# EAGLE design drawingBoard (EAGLE 8.0.1)
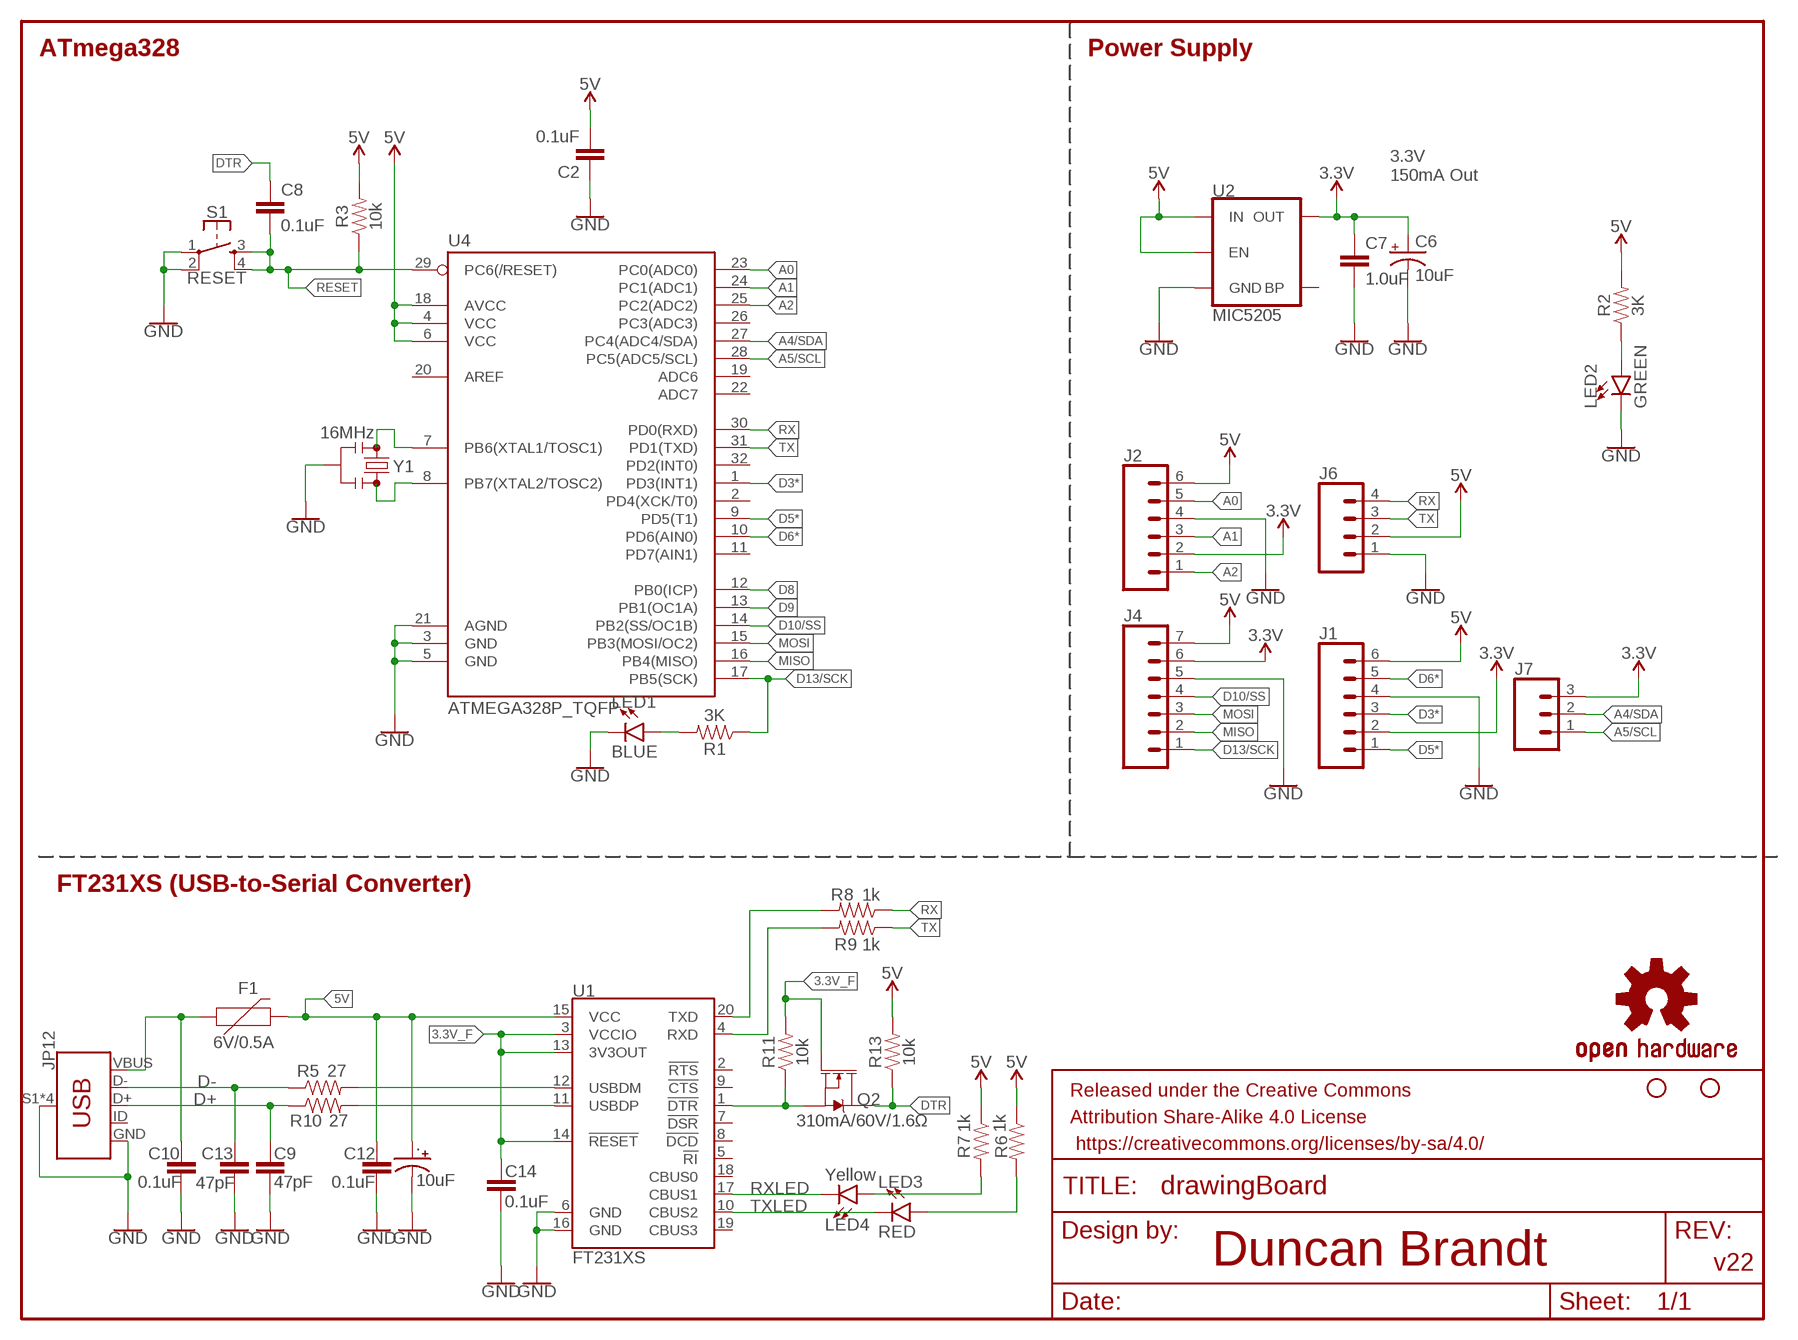
[diagram p0: schematic, sheet 1]

## Parts
.  10uF  10UF-POLAR-EIA3216-16V-10%(TANT)  [EIA3216]
C2  0.1uF  0.1UF-0603-25V-5%  [0603]
C6  10uF  10UF-POLAR-EIA3216-16V-10%(TANT)  [EIA3216]
C7  1.0uF  1.0UF-0603-16V-10%  [0603]
C8  0.1uF  0.1UF-0603-25V-5%  [0603]
C9  47pF  47PF-0603-50V-5%  [0603]
C10  0.1uF  0.1UF-0603-25V-5%  [0603]
C12  0.1uF  0.1UF-0603-25V-5%  [0603]
C13  47pF  47PF-0603-50V-5%  [0603]
C14  0.1uF  0.1UF-0603-25V-5%  [0603]
F1  6V/0.5A  PPTC_HALF-AMP  [1206]
FRAME2  FRAME-LETTER  [CREATIVE_COMMONS]
J1  CONN_06SILK_FEMALE_PTH  [1X06]
J2  CONN_06SILK_FEMALE_PTH  [1X06]
J4  CONN_07  [1X07]
J6  CONN_04  [1X04]
J7  CONN_03  [1X03]
JP3  STAND-OFF  [STAND-OFF]
JP6  STAND-OFF  [STAND-OFF]
JP12  USB_MINI-B_SMT  [USB-MINIB]
LED1  BLUE  LED-BLUE1206  [LED-1206]
LED2  GREEN  LED-GREEN1206  [LED-1206]
LED3  RED  LED-RED1206  [LED-1206]
LED4  Yellow  LED-YELLOW1206  [LED-1206]
Q2  310mA/60V/1.6Ω  MOSFET-NCH-2N7002PW  [SOT323]
R1  3K  3KOHM-0603-1/10W-1%  [0603]
R2  3K  3KOHM-0603-1/10W-1%  [0603]
R3  10k  10KOHM-0603-1/10W-1%  [0603]
R5  27  27OHM-0603-1/10W-1%  [0603]
R6  1k  1KOHM-0603-1/10W-1%  [0603]
R7  1k  1KOHM-0603-1/10W-1%  [0603]
R8  1k  1KOHM-0603-1/10W-1%  [0603]
R9  1k  1KOHM-0603-1/10W-1%  [0603]
R10  27  27OHM-0603-1/10W-1%  [0603]
R11  10k  10KOHM-0603-1/10W-1%  [0603]
R13  10k  10KOHM-0603-1/10W-1%  [0603]
S1  RESET  MOMENTARY-SWITCH-SPST-2-SMD-5.2MM  [TACTILE_SWITCH_SMD_5.2MM]
U1  FT231XS  [SSOP20_L]
U2  MIC5205  VREG3.3V3.3V  [SOT23-5]
U4  ATMEGA328P_TQFP  [TQFP32-08]
U$16  OSHW-LOGOS  [OSHW-LOGO-S]
Y1  16MHz  RESONATOR-16MHZSMD_3.2X1.3  [RESONATOR-SMD-3.2X1.3]

## Nets
3.3V: C6.+ C7.1 J1.2 J2.2 J4.6 J7.3 U2.5(OUT)
3.3V_F: C14.1 Q2.1(G) R11.2 U1.3(VCCIO) U1.13(3V3OUT) U1.14(!RESET)
5V: ..+ C2.2 C12.1 F1.2 J1.6 J2.6 J4.7 J6.2 R2.2 R3.2 R6.1 R7.1 R13.2 U1.15(VCC) U2.1(IN) U2.3(EN) U4.4(VCC) U4.6(VCC) U4.18(AVCC)
A0: J2.5 U4.23(PC0(ADC0))
A1: J2.3 U4.24(PC1(ADC1))
A2: J2.1 U4.25(PC2(ADC2))
A4/SDA: J7.2 U4.27(PC4(ADC4/SDA))
A5/SCL: J7.1 U4.28(PC5(ADC5/SCL))
D3*: J1.3 U4.1(PD3(INT1))
D5*: J1.1 U4.9(PD5(T1))
D6*: J1.5 U4.10(PD6(AIN0))
D8: U4.12(PB0(ICP))
D9: U4.13(PB1(OC1A))
D10/SS: J4.4 U4.14(PB2(SS/OC1B))
D13/SCK: J4.1 R1.1 U4.17(PB5(SCK))
D+: C9.1 JP12.D+ R10.1
D-: C13.1 JP12.D- R5.1
DTR: C8.1 Q2.3(D) R13.1
FTDI_DTR: Q2.2(S) R11.1 U1.1(!DTR)
GND [power]: ..- C2.1 C6.- C7.2 C9.2 C10.2 C12.2 C13.2 C14.2 J1.4 J2.4 J4.5 J6.1 JP12.GND JP12.S1(SHIELD) JP12.S2(SHIELD) JP12.S3(SHIELD) JP12.S4(SHIELD) LED1.C LED2.C S1.1 S1.2 U1.6(GND) U1.16(GND) U2.2(GND) U4.3(GND) U4.5(GND) U4.21(AGND) Y1.2
MISO: J4.2 U4.16(PB4(MISO))
MOSI: J4.3 U4.15(PB3(MOSI/OC2))
N$1: LED1.A R1.2
N$2: LED2.A R2.1
N$3: U4.7(PB6(XTAL1/TOSC1)) Y1.1
N$4: U4.8(PB7(XTAL2/TOSC2)) Y1.3
N$6: R5.2 U1.12(USBDM)
N$7: R10.2 U1.11(USBDP)
N$8: LED3.A R6.2
N$10: LED4.A R7.2
RESET: C8.2 R3.1 S1.3 S1.4 U4.29(PC6(/RESET))
RX: J6.4 R8.1 U4.30(PD0(RXD))
RXD: R9.2 U1.4(RXD)
RXLED: LED4.C U1.17(CBUS1)
TX: J6.3 R9.1 U4.31(PD1(TXD))
TXD: R8.2 U1.20(TXD)
TXLED: LED3.C U1.10(CBUS2)
VUSB: C10.1 F1.1 JP12.VBUS
Unconnected: JP12.ID U1.2(!RTS) U1.5(!RI) U1.7(!DSR) U1.8(!DCD) U1.9(!CTS) U1.18(CBUS0) U1.19(CBUS3) U2.4(BP) U4.2(PD4(XCK/T0)) U4.11(PD7(AIN1)) U4.19(ADC6) U4.20(AREF) U4.22(ADC7) U4.26(PC3(ADC3)) U4.32(PD2(INT0))

## Notes on the sheet
- ATmega328 | Power Supply
- 3.3V
  150mA Out
- FT231XS (USB-to-Serial Converter)
- Duncan Brandt | v22

## Library data of the parts
. C6 = DB-CAP:10UF-POLAR: 10.0µF polarized capacitors Package: EIA3216 A capacitor is a passive two-terminal electrical component used to store electrical energy temporarily in an electric field. DB BOARDS: DB Drawing Board <www.dbboards.com>; PROD_ID: CAP-00811
C2 C8 C10 C12 C14 = DB-CAP:0.1UF: 0.1µF ceramic capacitors Package: 0603 A capacitor is a passive two-terminal electrical component used to store electrical energy temporarily in an electric field. DB BOARDS: DB Drawing Board <www.dbboards.com>; PROD_ID: CAP-08604
C7 = DB-CAP:1.0UF: 1µF ceramic capacitors Package: 0603 A capacitor is a passive two-terminal electrical component used to store electrical energy temporarily in an electric field. DB BOARDS: DB Drawing Board <www.dbboards.com>; PROD_ID: CAP-00868
C9 C13 = DB-CAP:47PF: 47pF ceramic capacitors Package: 0603 A capacitor is a passive two-terminal electrical component used to store electrical energy temporarily in an electric field. DB BOARDS: DB Drawing Board <www.dbboards.com>; PROD_ID: CAP-08913
F1 = DB-FUSE:PPTC: Resettable Fuse PPTC Package: 1206 DB BOARDS: DB Drawing Board <www.dbboards.com>; PROD_ID: RES-08585
FRAME2 = DB-SYMBOLS:FRAME-LETTER: Schematic Frame - Letter Standard 8.5x11 US Letter frame
J1 J2 = DB-CONN:CONN_06: 6 Pin Header Multi connection point. Often used as Generic Header-pin footprint for 0.1 inch spaced/style header connections DB BOARDS: DB Drawing Board <www.dbboards.com>; PROD_ID: CONN-08437
J4 = DB-CONN:CONN_07: 7 Pin Header Multi connection point. Often used as Generic Header-pin footprint for 0.1 inch spaced/style header connections DB BOARDS: DB Drawing Board <www.dbboards.com>
J6 = DB-CONN:CONN_04: 4 Pin Header Single connection point. Often used as Generic Header-pin footprint for 0.1 inch spaced/style header connections DB BOARDS: DB Drawing Board <www.dbboards.com>; PROD_ID: CONN-09696
J7 = DB-CONN:CONN_03: 3 Pin Header Single connection point. Often used as Generic Header-pin footprint for 0.1 inch spaced/style header connections DB BOARDS: DB Drawing Board <www.dbboards.com>
JP3 JP6 = DB-HARDWARE:STAND-OFF: #4 Phillips Hole Screw Hole Mount Hole DB BOARDS: DB Drawing Board <www.dbboards.com>
JP12 = DB-CONN:USB_MINI-B: USB type Mini-B Connector Breaks out 5th pin, and includes shield pins if needed. SparkFun Products: SparkFun FTDI Basic Breakout <https://www.sparkfun.com/products/9716> SparkFun XBee Explorer USB <https://www.sparkfun.com/products/11812> SparkFun Redboard <https://www.sparkfun.com/products/12757>; PROD_ID: CONN-08193; SF_ID: PRT-00587
LED1 = DB-LED:LED-BLUE: Blue SMD LED Package: 1206 DB BOARDS: DB Drawing Board <www.dbboards.com>; PROD_ID: DIO-09911
LED2 = DB-LED:LED-GREEN: Green SMD LED Package: 1206 DB BOARDS: DB Drawing Board <www.dbboards.com>; PROD_ID: DIO-09910
LED3 = DB-LED:LED-RED: Red SMD LED Package: 1206 DB BOARDS: DB Drawing Board <www.dbboards.com>; PROD_ID: DIO-09912
LED4 = DB-LED:LED-YELLOW: Yellow SMD LED Package: 1206 DB BOARDS: DB Drawing Board <www.dbboards.com>; PROD_ID: DIO-09909
Q2 = DB-DESCSEMI:MOSFET-NCH: N-Channel MOSFETs Package: SOT323 DB BOARDS: DB Drawing Board <www.dbboards.com>; PROD_ID: TRANS-11151
R1 R2 = DB-RES:3KOHM: 3kΩ Resistor Package: 0603 A resistor is a passive two-terminal electrical component that implements electrical resistance as a circuit element. Resistors act to reduce current flow, and, at the same time, act to lower voltage levels within circuits. - Wikipedia DB BOARDS: DB Drawing Board <www.dbboards.com>; PROD_ID: RES-09334
R3 R11 R13 = DB-RES:10KOHM: 10kΩ Resistor Package: 0603 A resistor is a passive two-terminal electrical component that implements electrical resistance as a circuit element. Resistors act to reduce current flow, and, at the same time, act to lower voltage levels within circuits. - Wikipedia DB BOARDS: DB Drawing Board <www.dbboards.com>; PROD_ID: RES-00824
R5 R10 = DB-RES:27OHM: 27kΩ Resistor Package: 0603 A resistor is a passive two-terminal electrical component that implements electrical resistance as a circuit element. Resistors act to reduce current flow, and, at the same time, act to lower voltage levels within circuits. - Wikipedia DB BOARDS: DB Drawing Board <www.dbboards.com>; PROD_ID: RES-09334
R6-R9 = DB-RES:1KOHM: 1kΩ Resistor Package: 0603 A resistor is a passive two-terminal electrical component that implements electrical resistance as a circuit element. Resistors act to reduce current flow, and, at the same time, act to lower voltage levels within circuits. - Wikipedia DB BOARDS: DB Drawing Board <www.dbboards.com>; PROD_ID: RES-07856
S1 = DB-BTNSWTCH:MOMENTARY-SWITCH-SPST-2: SMD Momentary Push Button Package: SPST 4PIN DB BOARDS: DB Drawing Board <www.dbboards.com>; PROD_ID: SWCH-08247; SF_SKU: COM-08720
U1 = DB-COMM:FT231X: FTDI FT231X Full Speed USB to Full-handshake UART Package: SSOP20 This USB2.0 Full Speed IC offers a compact bridge to full handshake UART interfaces. The device is a UART, capable of operating up to 3MBaud, with low power consumption (8mA). The FT231X includes the complete FT-X series feature set and enables USB to be added into a system design quickly and easily over a UART interface. DB BOARDS: DB Drawing Board <www.dbboards.com>; PROD_ID: IC-11524
U2 = DB-POWER:VREG3.3V: V-REG 3.3V Package: SOT23-5 Standard 3.3V 150mA LDO voltage regulator in SOT-23 layout. BP (by-pass) pin is used to lower output noise with 470pF cap, may be left open. DB BOARDS: DB Drawing Board <www.dbboards.com>
U4 = DB-IC-Microcontroller:ATMEGA328P_TQFP: ATMEGA 328P Package: TQFP32 Arduino Programmable IC DB BOARDS: DB Drawing Board <www.dbboards.com>; PROD_ID: IC-09069
U$16 = DB-SYMBOLS:OSHW-LOGO: Open-Source Hardware (OSHW) Logo This logo indicates the piece of hardware it is found on incorporates a OSHW license and/or adheres to the definition of open source hardware found here: http://freedomdefined.org/OSHW
Y1 = DB-CLOCK:RESONATOR-16MHZ: 16MHz Resonator Package: 3.2x1.3 DB BOARDS: DB Drawing Board <www.dbboards.com>; PROD_ID: XTAL-08900

## Net classes
0 default: width 0.152 mm, drill 0.305 mm, clearance 0.152 mm
1 power: width 0.254 mm

## Board
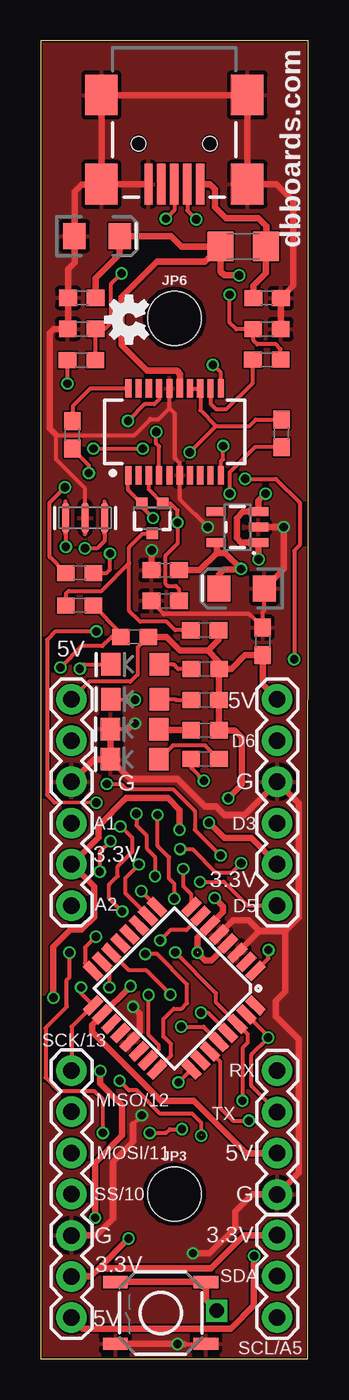
[diagram p1: board, top side]
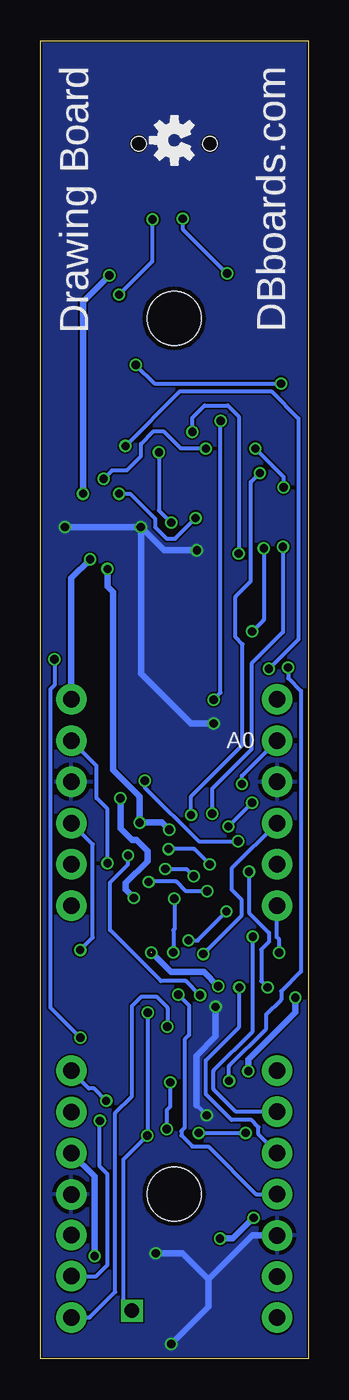
[diagram p2: board, bottom side, seen from below]

Size 16.51 x 81.27 mm. Coordinates in mm from the lower left corner, seen from the top.
Outline: 0,0 16.5,0 16.52,81.27 0,81.27 0,0
Copper layers (1*16): Top 0.035mm / dielectric 1.5mm / Bottom 0.035mm
Design rules "SparkFun-2-layer-FAB-LIMIT": minimum track width 4mil, minimum drill 6mil, track to track 4mil, track to pad 4mil, pad to pad 4mil, via to via 4mil, smd to smd 4mil, copper to edge 4mil, drill to drill 4mil, minimum pad ring 5mil, minimum via ring 5mil, stop-mask expansion 4mil, vias tented up to drill 25mil, thermal gap 10mil

### Footprints (pad centres in the part's own frame; a part is rotated, then mirrored left to right if it is on the bottom)
EIA3216 = smd 1.4 x 1.6: + 1.4,0; - -1.4,0
0603 = smd 1.1 x 1: 1 -0.85,0; 2 0.85,0
1206 = smd 1.6 x 1.8: 1 -1.4,0; 2 1.4,0
1X06 = drill 1.016 pad 1.88: 1 0,0; 2 2.54,0; 3 5.08,0; 4 7.62,0; 5 10.16,0; 6 12.7,0
1X07 = drill 1.016 pad 1.88: 1 0,0; 2 2.54,0; 3 5.08,0; 4 7.62,0; 5 10.16,0; 6 12.7,0; 7 15.24,0
1X04 = drill 1.016 pad 1.88: 1 0,0; 2 2.54,0; 3 5.08,0; 4 7.62,0
1X03 = drill 1.016 pad 1.88: 1 0,0; 2 2.54,0; 3 5.08,0
STAND-OFF = hole 3.302: 0,0
USB-MINIB = smd 2.5 x 0.5: D+ 2.5,0; D- 2.5,0.8; GND 2.5,-1.6; ID 2.5,-0.8; VBUS 2.5,1.6 | smd 2.5 x 2: S1 -3,4.5; S2 2.5,4.5; S3 -3,-4.5; S4 2.5,-4.5 | hole 0.9: 0,2.2; 0,-2.2
LED-1206 = smd 1.2 x 1.4: A -1.5,0; C 1.5,0
SOT323 = smd 0.7 x 0.7: 1 -0.65,-0.925; 2 0.65,-0.925; 3 0,0.925
TACTILE_SWITCH_SMD_5.2MM = smd 1.524 x 0.762: 1 -2.794,1.905; 2 2.794,1.905; 3 -2.794,-1.905; 4 2.794,-1.905
SSOP20_L = smd 0.381 x 1.143: 1 -2.857,-2.68; 2 -2.223,-2.68; 3 -1.587,-2.68; 4 -0.953,-2.68; 5 -0.318,-2.68; 6 0.318,-2.68; 7 0.953,-2.68; 8 1.587,-2.68; 9 2.223,-2.68; 10 2.857,-2.68; 11 2.857,2.68; 12 2.223,2.68; 13 1.587,2.68; 14 0.953,2.68; 15 0.318,2.68; 16 -0.318,2.68; 17 -0.953,2.68; 18 -1.587,2.68; 19 -2.223,2.68; 20 -2.857,2.68
SOT23-5 = smd 0.55 x 1.2: 1 -0.95,-1.3; 2 0,-1.3; 3 0.95,-1.3; 4 0.95,1.3; 5 -0.95,1.3
TQFP32-08 = smd 1.27 x 0.559: 1 -4.293,2.8; 2 -4.293,2; 3 -4.293,1.2; 4 -4.293,0.4; 5 -4.293,-0.4; 6 -4.293,-1.2; 7 -4.293,-2; 8 -4.293,-2.8; 17 4.293,-2.8; 18 4.293,-2; 19 4.293,-1.2; 20 4.293,-0.4; 21 4.293,0.4; 22 4.293,1.2; 23 4.293,2; 24 4.293,2.8 | smd 0.559 x 1.27: 9 -2.8,-4.293; 10 -2,-4.293; 11 -1.2,-4.293; 12 -0.4,-4.293; 13 0.4,-4.293; 14 1.2,-4.293; 15 2,-4.293; 16 2.8,-4.293; 25 2.8,4.293; 26 2,4.293; 27 1.2,4.293; 28 0.4,4.293; 29 -0.4,4.293; 30 -1.2,4.293; 31 -2,4.293; 32 -2.8,4.293
RESONATOR-SMD-3.2X1.3 = smd 0.45 x 1.905: 1 -1.2,0; 2 0,0; 3 1.2,0

### Placement (x,y rotation side)
.  3.49,69.22 0 top
C2  13.71,44.24 270 top
C6  12.41,47.5 180 top
C7  7.69,48.63 180 top
C8  2.41,46.45 0 top
C9  2.54,63.49 180 top
C10  13.98,65.4 0 top
C12  2.55,65.41 180 top
C13  13.97,63.48 0 top
C14  7.69,46.74 180 top
F1  12.51,68.58 180 top
FRAME2  39.4,36.39 0 top  (outside the outline)
J1  14.61,27.96 90 top
J2  1.91,27.96 90 top
J4  1.91,17.78 270 top
J6  14.61,10.14 90 top
J7  14.61,2.56 90 top
JP3  8.26,10.16 0 top
JP6  8.26,64.14 0 top
JP12  8.26,74.91 270 top
LED1  5.81,36.96 180 top
LED2  5.81,38.82 180 top
LED3  5.83,42.81 180 top
LED4  5.83,40.67 180 top
Q2  6.89,51.82 180 top
R1  10.15,36.98 0 top
R2  10.15,38.75 0 top
R3  5.8,44.51 0 top
R5  13.96,61.59 180 top
R6  10.18,42.53 180 top
R7  10.16,40.62 180 top
R8  1.96,56.96 90 top
R9  2.41,48.45 0 top
R10  2.53,61.58 180 top
R11  14.87,57.05 90 top
R13  10.14,44.92 0 top
S1  7.41,2.84 180 top
U1  8.27,57.15 0 top
U2  12.15,51.28 90 top
U4  8.26,22.85 225 top
U$7  OSHW-LOGOS  [OSHW-LOGO-S]  5.46,64.07 90 top
U$16  8.26,75.12 90 bottom
Y1  2.75,51.85 180 top

### Tracks (layer width: path | path; a pad name or v marks a point on that pad's centre or on a via)
3.3V  (via drill 0.51)
  Top 0.406: J4.6 3.1,5.08 3.61,5.6 | 3.61,5.6 10.52,5.6 12.56,7.64 J7.3 | 3.61,5.6 v5.44,7.42 | v3.69,17.74 3.69,16.99 5.04,15.64 5.04,13.77 3.37,12.1 v3.37,8.7 | v0.79,22.27 0.79,25.4 1.86,26.47 2.54,26.47 3.29,27.23 3.29,29.11 J2.2 3.57,32.16 3.57,32.86 5.28,34.57 7.86,34.57 8.57,33.85 v8.57,32.62 | J1.2 13,32.11 11.35,32.11 v10.4,33.06 | C7.1 9.81,48.62 10.87,49.69 | 10.87,49.69 10.87,50.3 U2.5 | 10.87,49.69 11.39,49.69 v12.38,48.7 12.34,48.66 11.31,48.66 11.01,48.36 C6.+
  Bottom 0.406: v3.69,17.74 3.69,18.45 0.79,21.35 v0.79,22.27 | v12.38,48.7 12.38,47.62 12.03,47.27 12.03,36.31 10.4,34.69 v10.4,33.06 9.01,33.06 v8.57,32.62 | v5.44,7.42 4.64,7.42 v3.37,8.7
3.3V_F  (via drill 0.51)
  Top 0.254: U1.14 U1.13 9.86,58.48 10.84,57.51 | 10.84,57.51 v9.21,55.88 | 10.84,57.51 12.89,57.51 13.29,57.91 R11.2 | U1.3 6.68,53.6 Q2.1 8.02,52.74 8.45,52.31 v8.45,51.55 8.48,51.53 8.48,50.29 7.7,49.51 7.7,47.8 7.84,47.66 8.35,47.66 8.54,47.47 C14.1
  Bottom 0.254: v9.21,55.88 9.21,52.31 v8.45,51.55
5V  (via drill 0.51)  (1 unrouted)
  Top 0.254: R3.2 5.99,43.85 5.99,42.19 5.56,41.75 3.01,41.75 J2.6
  Top 0.406: v13.18,6.35 13.18,3.29 11.75,1.86 2.59,1.86 J4.7 | J6.2 12.72,12.68 9.48,15.91 7.42,15.91 3.17,20.16 3.17,20.6 U4.18 v5.55,22.98 v5.56,22.98 | 10.44,26.71 U4.6 | U4.6 11.27,27.57 11.27,27.9 v10.76,28.42 | v11.59,34.57 12.42,35.4 12.42,38.3 11.99,38.73 11.02,38.73 R2.2 R7.1 11.01,42.51 R6.1 | R3.2 7.76,44.51 8.61,43.66 10.32,43.66 | 10.32,43.66 10.99,44.32 R13.2 | R6.1 11.03,42.95 10.32,43.66 | R6.1 11.77,42.53 12.62,43.38 13.7,43.38 C2.2 13.71,41.56 J1.6 | v13.45,49.29 U2.1 12.38,50.33 12.11,50.6 12.11,51.83 12.5,52.23 U2.3 13.45,52.9 v13.89,53.34 | F1.2 11.11,67.03 11.35,66.79 v12.26,66.79 | F1.2 8.69,68.58 8.05,69.22 ..+ 4.89,68.11 3.41,66.64 3.41,65.43 C12.1 | F1.2 10.16,67.63 7.18,67.63 5,65.44 5,62.51 6.59,60.92 8.41,60.92 8.61,60.72 8.61,59.85 U1.15 | U4.4 10.54,24.57 10.16,24.57 v9.68,25.04 9.68,25.98 U4.6
  Bottom 0.406: v13.18,6.35 13.18,11.25 J6.2 | v5.56,22.98 6.43,23.85 8.45,23.85 9.68,25.08 | v10.76,28.42 11.27,28.93 11.27,29.33 9.92,30.68 9.92,31.31 10.6,31.99 10.87,31.99 11.59,32.7 v11.59,34.57 | J1.6 14.61,48.13 v13.45,49.29 | v13.89,53.34 13.89,65.17 v12.26,66.79 | J4.7 1.95,2.54 1.95,2.5
A0  (via drill 0.51)
  Top 0.254: v4.09,35.44 4.96,35.44 5.28,35.12 8.18,35.12 9.53,33.77 9.53,32.62 v11.11,31.04 | U4.23 7.3,19.07 7.3,19.33 6.67,19.96 v6.67,22.42
  Bottom 0.254: v4.09,35.44 4.09,35.94 J2.5 | v6.67,22.42 7.54,23.3 9.09,23.3 12.22,26.43 12.22,29.37 11.11,30.48 v11.11,31.04
A1  (via drill 0.51)
  Top 0.254: U4.24 8.06,18.69 8.06,19.41 7.58,19.88 7.58,20.95 8.21,21.59 8.69,21.59 9.05,21.95 9.05,23.1 7.18,24.96 v6.47,24.96
  Bottom 0.254: J2.3 4.72,30.23 4.72,28.93 4.13,28.34 4.13,27.3 v6.47,24.96
A2  (via drill 0.51)
  Top 0.254: v1.79,25.04 1.79,23.54 1.63,23.38 1.63,21.71 0.32,20.4 0.32,17.34 1.15,16.51 3.33,16.51 3.85,15.99 v3.85,13.93 | v6.75,13.93 7.74,13.93 7.98,14.17 v8.73,14.17 | v8.51,17.05 8.52,17.05 U4.25
  Bottom 0.254: v6.75,13.93 v3.85,13.93 | v8.73,14.17 8.73,15.32 8.49,15.56 8.49,17.03 v8.51,17.05 | v1.79,25.04 1.79,25.85 1.94,26 1.94,27.93 J2.1
A4/SDA  (via drill 0.51)
  Top 0.254: U4.27 11.07,18.34 11.07,15.48 11.87,14.68 v12.86,14.68
  Bottom 0.254: J7.2 13.08,5.1 12.38,5.79 12.38,11.39 12.86,11.87 v12.86,14.68
A5/SCL  (via drill 0.51)
  Top 0.254: v8.69,20.48 10.06,20.48 U4.28
  Bottom 0.254: J7.1 13.48,2.56 11.91,4.13 11.91,15.16 10.87,16.19 10.87,21.75 10.28,22.34 9.37,22.34 8.69,21.67 v8.69,20.48
D3*  (via drill 0.51)
  Top 0.254: U4.1 14.06,24.7 v14.06,25.21
  Bottom 0.254: J1.3 13.29,31.72 13.29,25.98 v14.06,25.21
D5*  (via drill 0.51)
  Top 0.254: 7.06,27.87 U4.9 6.24,28.83 v6.22,28.83 | 14.55,28.02 J1.1 12.76,27.96 11.31,29.41 v9.84,29.41
  Bottom 0.254: v6.22,28.83 7.53,28.83 8.13,29.43 9.82,29.43 v9.84,29.41
D6*  (via drill 0.51)
  Top 0.254: v8.61,31.43 9.37,31.43 10.79,30 11.83,30 v12.38,30.56 | U4.10 5.24,28.7 5.24,29.65 v6.07,30.48
  Bottom 0.254: v12.38,30.56 12.38,33.89 13.06,34.57 13.06,36.56 J1.5 | v6.07,30.48 7.03,31.43 v8.61,31.43
D10/SS  (via drill 0.51)
  Top 0.254: U4.14 5.44,23.97 6.51,23.97 v8.02,22.46
  Bottom 0.254: v8.02,22.46 7.34,21.79 7.34,19.96 7.62,19.68 7.62,14.25 7.82,14.05 7.82,13.77 7.14,13.1 6.15,13.1 3.21,10.16 J4.4
D13/SCK  (via drill 0.51)
  Top 0.254: R1.1 9.3,36.42 v10.08,35.64 | v2.5,22.9 2.5,22.54 U4.17 1.91,20.47 J4.1 | v4.32,31.91 3.65,31.24 v3.65,30.04
  Bottom 0.254: v10.08,35.64 10.08,35.24 6.75,31.91 v4.32,31.91 | v3.65,30.04 3.65,27.5 2.42,26.27 2.42,25.72 2.9,25.24 2.9,23.3 v2.5,22.9
D+  (via drill 0.51)
  Top 0.254: JP12.D+ 8.26,70.8 v7.74,70.29 | v5,66.91 4.37,66.28 4.37,63.9 3.96,63.49 C9.1 R10.1
  Bottom 0.254: v7.74,70.29 7.74,69.65 v5,66.91
D-  (via drill 0.51)
  Top 0.254: R5.1 14.81,62.26 14.53,62.55 13.38,62.55 13.14,62.79 13.14,63.46 C13.1 12.09,63.48 11.67,63.9 v11.67,65.6 | JP12.D- 9.05,70.8 v9.6,70.25
  Bottom 0.254: v9.6,70.25 9.6,67.67 v11.67,65.6
DTR
  Top 0.254: C8.1 1.56,47.16 1.75,47.35 3.77,47.35 5.48,49.05 | 5.48,49.05 5.48,50.05 6.31,50.88 6.88,50.88 Q2.3 | R13.1 8.3,44.92 7.78,45.44 6.15,45.44 5.48,46.12 5.48,49.05
FTDI_DTR  (via drill 0.51)
  Top 0.254: Q2.2 | R11.1 13.22,56.2 11.67,54.65 v11.67,53.34 | Q2.2 6.24,52.54 v6.95,51.83 | Q2.2 5.41,53.57 U1.1
  Bottom 0.254: v11.67,53.34 10.99,53.34 9.45,51.79 9.45,51.28 8.73,50.56 8.21,50.56 v6.95,51.83
GND  (via drill 0.51)
  Top 0.254: Y1.2 2.75,53.65 0.95,55.44 0.95,56.95 5.79,56.95 6.79,57.94 7.29,57.94 7.95,58.6 | 13.49,51.32 U2.2 | 13.7,45.1 C2.1 | C2.1 12.88,45.92 7.62,45.92 6.84,46.7 C14.2 | LED1.C 4.47,36.97 | 7.95,59.19 U1.16 7.95,58.6 | 7.95,58.6 8.29,58.26 8.29,55.52 8.59,55.23 U1.6 8.59,53.01 v10.32,51.28 | 8.89,0.91 10.18,0.91 S1.1 | C2.1 13.71,46.03 13.81,46.14 C6.- | 5.71,14.45 6.25,14.99 v6.25,15.02 | LED2.C 5.48,38.82 v5.83,39.17
  Top 0.406: J2.4 3.3,36.97 LED1.C | LED1.C LED2.C | v9.41,6.51 10.44,6.51 12.03,8.1 12.03,9.09 13.08,10.14 J6.1 15.95,11.49 15.95,19.68 14.53,21.11 14.53,22.07 15.12,22.66 15.12,26.39 | 15.12,26.39 15.95,27.23 15.95,34.23 J1.4 12.57,33.54 11.35,33.54 10.84,34.05 10.16,34.05 8.45,35.76 5.52,35.76 LED1.C | U4.3 13.49,26.39 | 13.49,26.39 15.12,26.39 | 13.49,26.39 12.86,27.03 11.87,27.03 U4.5 | J4.5 3.45,7.62 4.49,8.65 4.49,12.14 5.71,13.38 5.71,14.45 | v5.71,21.71 6.11,21.31 6.11,20.14 U4.21 | 0.95,56.95 0.56,57.35 0.56,63.22 0.83,63.49 C9.2 C12.2 1.7,67.18 2.1,67.59 2.1,69.21 ..- 2.09,71.94 2.54,72.39 3.73,72.39 JP12.S4 | U2.2 v15,51.28 15,48.69 C6.- | C7.2 6.87,48.65 v6.87,49.85 | C13.2 14.82,65.39 C10.2 15.6,66.17 15.6,71.36 14.54,72.41 JP12.S2 JP12.S1 JP12.S3 JP12.S4 | 8.89,0.91 v8.45,0.91 8.43,0.94 S1.2 | JP12.S4 JP12.GND
  Bottom 0.254: v6.25,15.02 6.87,15.64 6.91,15.64
  Bottom 0.406: 6.15,4.92 7.74,6.51 v9.41,6.51 | J4.5 3.45,7.62 6.15,4.92 | 6.91,15.64 6.91,18.69 5.71,19.88 v5.71,21.71 | v5.83,39.17 7.22,39.17 10.32,42.27 v10.32,51.28 | v6.87,49.85 8.89,49.85 v10.32,51.28 | v10.32,51.28 v15,51.28 | v8.45,0.91 6.15,3.21 6.15,4.92
  pour Bottom: 0,0 16.51,0 16.51,81.28 0,81.28
  pour Top: 0,0 16.51,0 16.51,81.28 0,81.28
MISO  (via drill 0.51)
  Top 0.254: v3.41,26.04 2.74,25.36 2.74,24.41 U4.16
  Bottom 0.254: J4.2 4.45,15.24 5.83,16.63 5.83,17.78 3.41,20.2 v3.41,26.04
MOSI  (via drill 0.51)
  Top 0.254: U4.15 4.25,24.03 v4.25,22.9
  Bottom 0.254: J4.3 3.06,13.84 3.06,14.29 3.49,14.72 4.72,14.72 6.31,16.31 6.31,18.41 4.25,20.48 v4.25,22.9
N$1
  Top 0.254: R1.2 10.16,37.82 8.17,37.82 LED1.A
N$2
  Top 0.254: 9.29,38.77 R2.1
  Top 0.406: 9.29,38.77 7.31,38.77 LED2.A
N$3  (via drill 0.51)
  Top 0.203: 0.87,34.29 v3.45,34.29
  Top 0.254: 3.95,50.83 Y1.1 3.95,50.42 3.49,49.97 v2.74,49.97 | v3.45,44.85 0.91,44.85 0.4,44.33 0.4,34.77 0.87,34.29 | U4.7 9.01,26.43 8.02,26.43 v7.38,25.8 | v5.04,27.58 4.25,28.38 4.25,29.25 4.76,29.77 4.76,30.36 5.67,31.27 5.67,32.11 4.96,32.82 v4.92,32.82
  Bottom 0.254: v2.74,49.97 2.74,45.56 v3.45,44.85 | v3.45,34.29 v4.92,32.82 4.96,32.82 | v7.38,25.8 6.83,25.8 v5.04,27.58
N$4  (via drill 0.51)
  Top 0.254: 1.55,50.83 Y1.3 | Y1.3 1.59,51.81 | U4.8 9.31,28.63 8.81,29.13 v8.81,30.2 | v5.91,33.62 5.91,32.9 6.55,32.27 6.55,31.47 7.06,30.96 v7.06,29.77 | Y1.3 1.55,50.08 v1.56,50.07
  Bottom 0.254: v5.91,33.62 5.91,35.16 3.49,37.58 3.49,42.86 1.56,44.8 v1.56,50.07 | v8.81,30.2 7.5,30.2 v7.06,29.77
N$6
  Top 0.254: U1.12 10.49,58.88 10.84,58.54 11.47,58.54 13.1,60.17 13.1,61.58 R5.2
N$7  (via drill 0.51)
  Top 0.254: v10.64,61.28 11.13,60.78 U1.11 | v1.67,60.13 1.68,60.14 R10.2
  Bottom 0.254: v10.64,61.28 9.48,60.13 v1.67,60.13
N$8
  Top 0.254: R6.2 8.49,42.53 8.22,42.8 7.34,42.8 LED3.A
N$10
  Top 0.254: LED4.A 8.32,40.67 8.38,40.61 9.29,40.61 R7.2
RESET  (via drill 0.51, 0.9)  (1 unrouted)
  Top 0.254: C8.2 4.95,44.76 R3.1 4.38,44.51 3.81,43.93 2.54,43.93 v1.23,42.62 | v9.92,13.77 9.92,14.56 9.37,15.12 7.38,15.12 5.95,16.55 5.48,16.55 v4.88,17.14 | v9.9,21.35 10.32,21.35 U4.29
  Top 0.406: S1.4 S1.3 10.21,3.64 v10.87,2.98
  Bottom 0.254: v4.88,17.14 4.88,18.06 2.58,20.36 2.58,21.23 1.67,22.15 1.67,22.66 0.45,23.88 0.45,41.18 1.23,41.97 v1.23,42.62 | v9.92,13.77 11.39,12.3 11.39,3.49 v10.87,2.98 | v9.9,21.35 9.9,13.79
RX  (via drill 0.51)
  Top 0.254: R8.1 2.98,55.09 v2.98,54.61 | v8.26,28.38 8.26,29.29 7.94,29.61 7.94,30.92 7.22,31.63 v7.22,33.54 | v12.46,15.91 12.46,19.17 12.78,19.49 12.78,20.02 U4.30 10.84,21.97 10.84,22.54 v8.32,25.06
  Bottom 0.254: v2.98,54.61 3.53,54.05 3.53,47.94 4.49,46.99 4.49,44.49 4.05,44.05 4.05,37.86 7.22,34.69 v7.22,33.54 | v12.46,15.91 13.22,16.67 13.53,16.67 14.61,17.75 J6.4 | v8.26,28.38 8.26,26.48 8.32,26.42 v8.32,25.06 8.33,25.04
RXD  (via drill 0.51)
  Top 0.254: R9.2 4.08,48.45 4.29,48.66 v4.29,49.65 | U1.4 7.32,56.26 7.14,56.44 v7.14,57.15
  Bottom 0.254: v7.14,57.15 7.14,58.02 6.39,58.78 4.96,58.78 4.29,58.1 v4.29,49.65
RXLED  (via drill 0.51)
  Top 0.254: U1.17 7.32,59.15 7.03,58.86 6.43,58.86 v5.4,57.83 | LED4.C 4.36,40.64 v5.83,40.64
  Bottom 0.254: v5.83,40.64 5.4,41.08 v5.4,57.83
TX  (via drill 0.51)
  Top 0.254: v3.25,56.12 v6.31,56.12 | v12.62,54.25 14.53,54.25 15.99,52.78 15.99,50.16 15.65,49.83 v15.65,43.13 | U4.31 14.05,19.89 v14.05,19.8 13.02,18.77 13.02,16.82 J6.3 | R9.1 0.56,49.46 0.56,52.78 v1.51,53.74
  Bottom 0.254: v1.51,53.74 1.51,54.37 v3.25,56.12 | v6.31,56.12 7.86,56.12 8.93,57.19 9.53,57.19 10.32,56.4 10.32,55.64 11.19,54.77 12.11,54.77 v12.62,54.25 | v15.65,43.13 15.65,41.53 15.91,41.27 15.91,21.67 v14.05,19.8
TXD
  Top 0.254: U1.20 3.08,59.83 1.98,58.74 1.98,57.83 R8.2
TXLED  (via drill 0.51)
  Top 0.254: U1.10 11.13,55.32 11.27,55.47 v11.27,56.28 | v2.42,42.55 2.69,42.81 LED3.C
  Bottom 0.254: v11.27,56.28 7.9,59.65 2.28,59.65 0.6,57.98 0.6,44.36 v2.42,42.55
VUSB
  Top 0.406: C10.1 13.14,66.16 13.91,66.93 F1.1 13.94,68.61 13.94,69.82 13.43,70.33 11.43,70.33 10.76,71 10.76,71.51 10.76,71.52 10.76,72.1 10.45,72.41 JP12.VBUS

### Text on the board
tPlace: dbboards.com | 5V | 5V | D6 | G | G | A1 | D3 | 3.3V | 3.3V | A2 | D5 | SCK/13 | RX | MISO/12 | TX | MOSI/11 | 5V | SS/10 | G | G | 3.3V | 3.3V | SDA | 5V | SCL/A5
bPlace: DBboards.com | Drawing Board | A0
200bmp: /Users/Duncan/Desktop/DBboardsPSDs/PCBlogo.bmp